# EasyEDA Pro project OptoGrid_V0.05.eprj, board OptoGrid_Battery_V0.05
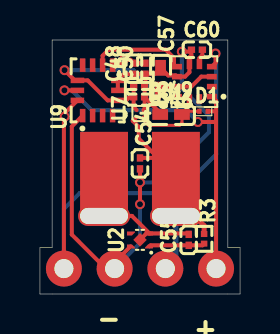
[diagram p11: board, top side]
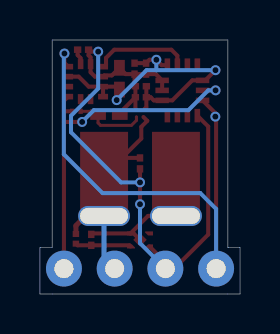
[diagram p12: board, bottom side, seen from below]

Outline 10.02 x 12.71 mm; copper layers: Top Layer, Bottom Layer. Coordinates in mm from the lower left corner of the outline.
Outline path: 0,2.32 0,0 0.61,0 9.41,0 10.02,0 10.02,2.32 9.41,2.32 9.41,12.71 0.61,12.71 0.61,2.32 0,2.32
Stack: Top Layer 0.035mm / Dielectric1 0.53mm FR4 er 4.5 / Bottom Layer 0.035mm

## Design rules (mm)
template: 自定义配置
spacing copperThickness1oz (default): track to track 0.102, other pairs 0.152 to 0.3
spacing copperThickness2oz: track to track 0.203, other pairs 0.152 to 0.3
track width copperThickness1oz (default): min 0.102, default 0.203, max 2.54
track width copperThickness2oz: min 0.203, default 0.254, max 2.54
differential pair differentialPair (default): width min 0.127, default 0.254, max 2.54; gap min 0.152, default 0.152
via viaSize (default): diameter min 0.5, default 0.61, max 10; hole min 0.3, default 0.305, max 6.3

## Placement (name value [footprint] x y rotation side)
C46  2.2uF  [C0201]  4.97 9.84 180 top
C48  2.2uF  [C0201]  4.7 11.27 90 top
C49  10nF  [C0201]  4.97 10.39 180 top
C50  100nF  [C0201]  5.28 11.27 90 top
C54  2.2uF  [C0201]  5.01 6.53 270 top
C55  100nF  [C0201]  7.45 2.71 90 top
C57  10uF  [C0402]  6.04 10.77 270 top
C60  220nF  [C0201]  7.86 12.22 0 top
C61  2.2uF  [C0402]  6.57 8.98 0 top
D1  BAT30F4  [DFN0603-D_L0.6-W0.3-P0.34-RD]  8.19 9.14 0 top
NOREF  -  [Pad_e86]  3.21 5.91 0 top
NOREF#2  -  [Pad_e33]  3.74 1.27 0 top
NOREF#3  -  [Pad_e41]  1.2 1.27 0 top
NOREF#4  -  [Pad_e42]  8.82 1.27 0 top
NOREF#5  -  [Pad_e82]  3.21 3.91 0 top
NOREF#6  -  [Pad_e31]  6.28 1.27 0 top
NOREF#7  -  [Pad_e90]  6.81 5.91 0 top
NOREF#8  -  [Pad_e88]  6.81 3.91 0 top
R3  510Ω  [R0201]  8.22 2.76 270 top
U2  DS6101AED4  [DFN-4_L1.0-W1.0-P0.65-BL-EP]  5.01 2.7 90 top
U7  NCP163AFCT330T2G  [WLCSP-4_L0.6-W0.6-P0.35-R2-C2-TL]  5.01 9.03 90 top
U8  LIS2MDLTR  [LGA-12_L2.0-W2.0-P0.50-BL]  7.74 10.62 90 top
U9  IIM-42652  [LGA-14_L3.0-W2.5-P0.50-TL]  2.89 10.19 90 top

## Footprints (pads in the part's own frame, mm; a bottom-side part is the same pattern mirrored in y, then rotated)
C0201
  rect 0.368x0.324 smd: 1(-0.275,0) 2(0.275,0)
C0402
  rect 0.79x0.54 smd: 1(-0.545,0) 2(0.545,0)
DFN0603-D_L0.6-W0.3-P0.34-RD
  rect 0.22x0.26 smd: 1(-0.21,0) 2(0.21,0)
DFN-4_L1.0-W1.0-P0.65-BL-EP
  custom 0.2x0.4 smd: 1(-0.325,-0.475) 2(0.325,-0.474) 3(0.325,0.475) 4(-0.325,0.475)
  rect 0.48x0.48 smd rot 45: 5(0.004,0.001)
LGA-12_L2.0-W2.0-P0.50-BL
  rect 0.28x0.5 smd: 1(-0.75,-0.875) 2(-0.25,-0.875) 3(0.25,-0.875) 4(0.75,-0.875) 7(0.75,0.875) 8(0.25,0.875) 9(-0.25,0.875) 10(-0.75,0.875)
  rect 0.5x0.28 smd: 5(0.875,-0.25) 6(0.875,0.25) 11(-0.875,0.25) 12(-0.875,-0.25)
LGA-14_L3.0-W2.5-P0.50-TL
  rect 0.675x0.28 smd: 1(-1.262,0.75) 2(-1.262,0.25) 3(-1.262,-0.25) 4(-1.262,-0.75) 8(1.262,-0.75) 9(1.262,-0.25) 10(1.262,0.25) 11(1.262,0.75)
  rect 0.28x0.675 smd: 5(-0.5,-1.012) 6(0,-1.012) 7(0.5,-1.012) 12(0.5,1.012) 13(0,1.012) 14(-0.5,1.012)
Pad_e31
  round 1.8 hole 0.95: 1(0,0)
Pad_e33
  round 1.8 hole 0.95: 2(0,0)
Pad_e41
  round 1.8 hole 0.95: 2(0,0)
Pad_e42
  round 1.8 hole 0.95: 2(0,0)
Pad_e82
  oval 2.6x1 hole 2.4x0.8: 1(0,0)
Pad_e86
  rect 2.4x4.4 smd: 1(0,0)
Pad_e88
  oval 2.6x1 hole 2.4x0.8: 1(0,0)
Pad_e90
  rect 2.4x4.4 smd: 1(0,0)
R0201
  rect 0.303x0.324 smd: 1(-0.241,0) 2(0.241,0)
WLCSP-4_L0.6-W0.6-P0.35-R2-C2-TL
  round 0.158 smd: A1(-0.175,0.175) A2(0.175,0.175) B1(-0.175,-0.175) B2(0.175,-0.175)

## Nets
GND: C46.1 C48.1 C49.1 C50.1 C54.2 C57.1 C60.1 C61.1 NOREF#2.2 U2.4 U7.B2 U8.6 U8.8 U9.1 U9.6 U9.7
VCC: C46.2 C48.2 C49.2 C50.2 C57.2 U7.A2 U8.3 U8.9 U8.10 U9.5 U9.8 U9.12
BAT+: C54.1 NOREF#6.1 NOREF#7.1 NOREF#8.1 R3.1 U7.A1
BAT-: C55.2 NOREF.1 NOREF#5.1 U2.2 U2.5
SCL: D1.2 NOREF#4.2 U8.1 U9.13
SDA: NOREF#3.2 U8.4 U9.14
SYNC: U8.7 U9.9
$1N1923: C60.2 U8.5
$1N2753: C55.1 R3.2 U2.1
$1N3706: C61.2 D1.1 U7.B1

Pads without a net: U2 3; U8 2 11 12; U9 2 3 4 10 11

## Via types
v1: diameter 0.5, hole 0.3, Top Layer to Bottom Layer, 10 vias

## Routing (per net, layer and track width the routed paths; a pad name or vN(x,y) marks a point on that pad's centre or on a via; arc(x,y) is an arc through that point)
GND: length 34.5
  Top Layer w0.203: C50.1 C48.1 4.21,11 U9.7 U9.6 ; C50.1 5.72,11 C57.1 6.04,11.15 6.21,11.15 6.42,10.93 6.8,10.93 U8.8 7.27,10.87 7.49,11.09 U8.6 7.49,11.83 7.59,11.94 C60.1 7.49,12.12 v1(7.1,12.12) ; C50.1 5.28,10.43 C49.1 C46.1 ; U7.B2 5.24,9.26 C46.1 ; v1(5.01,4.49) v1(5.01,5.58) C54.2 ; C46.1 6.02,9.06 6.02,8.97 ; U9.1 1.6,8.38 1.6,2.97 3.3,1.27 NOREF#2.2 3.74,1.58 U2.4
  Bottom Layer w0.203: v1(5.01,5.58) 5.96,5.58 8.47,8.09 8.47,8.92 7.1,10.28 v1(7.1,12.12) ; NOREF#2.2 5.01,2.54 v1(5.01,4.49)
VCC: length 16.7
  Top Layer w0.203: C57.2 6.19,10.37 U8.9 ; C46.2 4.69,9.35 U7.A2 ; C46.2 4.47,9.84 4.32,9.69 U9.5 3.39,9.69 2.39,10.69 U9.12 1.74,10.69 v1(1.23,11.2) ; C46.2 C49.2 ; U9.8 3.92,11.45 v1(4.19,11.72) 4.54,11.72 4.7,11.55 5.28,11.55 ; U8.9 7.58,10.37 8.08,10.87 8.61,10.87 ; U8.9 U8.10
  Bottom Layer w0.203: v1(4.19,11.72) 4.19,11.2 4.19,11.2 ; v1(6.18,9.7) 4.68,11.2 4.19,11.2 ; v1(1.23,11.2) 4.19,11.2
BAT+: length 9.7
  Top Layer w0.203: 5.91,6.81 NOREF#7.1 ; 5.91,6.81 4.95,7.78 4.95,8.36 4.65,8.66 U7.A1 ; 5.91,6.81 5.01,6.81
  Top Layer w0.254: R3.1 8.22,3.42 7.73,3.91 NOREF#8.1
  Bottom Layer w0.254: NOREF#8.1 6.81,1.8 NOREF#6.1
BAT-: length 5.2
  Top Layer w0.203: NOREF#5.1 4.61,3.91 U2.2 ; U2.2 7.41,3.03 C55.2 ; U2.2 5.33,3.03 U2.5
SCL: length 18
  Top Layer w0.203: 8.82,9.14 8.81,9.14 D1.2 ; 8.82,9.14 8.82,8.6 ; 8.82,9.14 8.82,9.66 U8.1 ; v1(1.23,10.19) 1.87,10.19 U9.13 ; 8.82,8.6 8.82,8.61 v1(7.91,8.61) ; 8.82,8.6 NOREF#4.2
  Bottom Layer w0.203: v1(7.91,8.61) 7.32,9.2 2.59,9.2 1.59,10.19 v1(1.23,10.19)
SDA: length 26.2
  Top Layer w0.203: NOREF#3.2 1.2,8.83 v1(1.24,8.87) 1.24,9.05 U9.14 ; U8.4 8.79,11.56 v1(8.79,12.03)
  Bottom Layer w0.203: NOREF#3.2 1.2,4.26 1.99,5.05 6.88,5.05 8.82,6.99 8.82,12 v1(8.79,12.03)
SYNC: length 4.7
  Top Layer w0.203: 6.71,11.49 6.71,11.81 6.3,12.22 3.44,12.22 3.14,11.92 U9.9
$1N1923: length 0.8
  Top Layer w0.203: C60.2 8.13,11.95 7.99,11.8 U8.5
$1N2753: length 2.8
  Top Layer w0.203: R3.2 8.14,2.44 C55.1 5.54,2.44 U2.1
$1N3706: length 3.6
  Top Layer w0.152: D1.1 7.27,9.14 C61.2 ; 7.11,8.97 7.11,8.56 6.99,8.44 5.44,8.44 5.19,8.69 U7.B1

## Text on the board
Top Silkscreen Layer: OptoGrid_Battery_V0.05 | - | +
